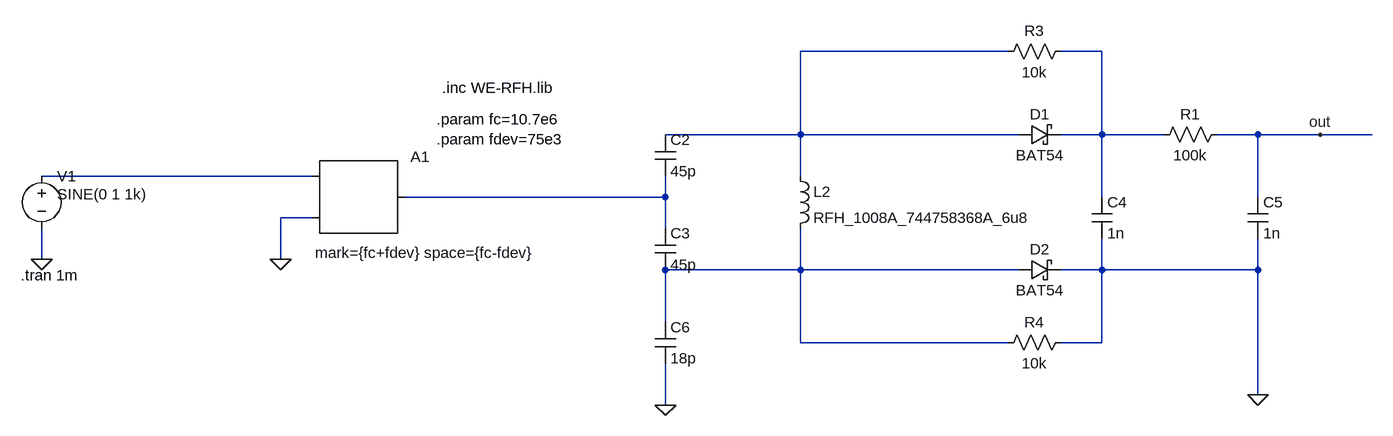
[diagram p0: schematic Weiss_discriminator_actual_values.asc]
Weiss_discriminator_actual_values.asc, the LTspice schematic file:
Version 4
SHEET 1 1816 680
WIRE 1168 -96 848 -96
WIRE 1312 -96 1248 -96
WIRE 848 32 848 -96
WIRE 848 32 640 32
WIRE 1184 32 848 32
WIRE 1312 32 1312 -96
WIRE 1312 32 1248 32
WIRE 1408 32 1312 32
WIRE 1552 32 1488 32
WIRE 1648 32 1552 32
WIRE 1728 32 1648 32
WIRE 96 96 -320 96
WIRE 848 96 848 32
WIRE 640 128 640 96
WIRE 640 128 240 128
WIRE 1312 128 1312 32
WIRE 1552 128 1552 32
WIRE 96 160 48 160
WIRE 640 176 640 128
WIRE -320 224 -320 176
WIRE 48 224 48 160
WIRE 1552 240 1552 192
WIRE 848 240 848 176
WIRE 848 240 640 240
WIRE 1184 240 848 240
WIRE 1312 240 1312 192
WIRE 1312 240 1248 240
WIRE 1552 240 1312 240
WIRE 640 320 640 240
WIRE 848 352 848 240
WIRE 1168 352 848 352
WIRE 1312 352 1312 240
WIRE 1312 352 1248 352
WIRE 1552 432 1552 240
WIRE 640 448 640 384
FLAG 48 224 0
FLAG -320 224 0
FLAG 640 448 0
FLAG 1552 432 0
FLAG 1648 32 out
SYMBOL SpecialFunctions\\modulate 96 96 R0
WINDOW 3 5 118 Left 2
SYMATTR Value mark={fc+fdev} space={fc-fdev}
SYMATTR InstName A1
SYMBOL voltage -320 80 R0
WINDOW 123 0 0 Left 0
WINDOW 39 0 0 Left 0
WINDOW 3 24 44 Left 2
SYMATTR Value SINE(0 1 1k)
SYMATTR InstName V1
SYMBOL cap 624 32 R0
SYMATTR InstName C2
SYMATTR Value 45p
SYMBOL cap 624 176 R0
SYMATTR InstName C3
SYMATTR Value 45p
SYMBOL schottky 1184 48 R270
WINDOW 0 32 32 VTop 2
WINDOW 3 0 32 VBottom 2
SYMATTR InstName D1
SYMATTR Value BAT54
SYMATTR Description Diode
SYMATTR Type diode
SYMBOL schottky 1184 256 R270
WINDOW 0 32 32 VTop 2
WINDOW 3 0 32 VBottom 2
SYMATTR InstName D2
SYMATTR Value BAT54
SYMATTR Description Diode
SYMATTR Type diode
SYMBOL cap 1296 128 R0
SYMATTR InstName C4
SYMATTR Value 1n
SYMBOL res 1504 16 R90
WINDOW 0 0 56 VBottom 2
WINDOW 3 32 56 VTop 2
SYMATTR InstName R1
SYMATTR Value 100k
SYMBOL cap 1536 128 R0
SYMATTR InstName C5
SYMATTR Value 1n
SYMBOL cap 624 320 R0
SYMATTR InstName C6
SYMATTR Value 18p
SYMBOL res 1264 -112 R90
WINDOW 0 0 56 VBottom 2
WINDOW 3 32 56 VTop 2
SYMATTR InstName R3
SYMATTR Value 10k
SYMBOL res 1264 336 R90
WINDOW 0 0 56 VBottom 2
WINDOW 3 32 56 VTop 2
SYMATTR InstName R4
SYMATTR Value 10k
SYMBOL ind 832 80 R0
SYMATTR InstName L2
SYMATTR Value RFH_1008A_744758368A_6u8
SYMATTR Prefix X
TEXT -352 248 Left 2 !.tran 1m
TEXT 288 8 Left 2 !.param fc=10.7e6\n.param fdev=75e3
TEXT 296 -40 Left 2 !.inc WE-RFH.lib

The netlist it stands for:
* Weiss_discriminator_actual_values.asc
A1 N003 0 0 0 0 0 N004 0 MODULATOR mark={fc+fdev} space={fc-fdev}
V1 N003 0 SINE(0 1 1k)
C2 N001 N004 45p
C3 N004 N005 45p
D1 N001 N002 BAT54
D2 N005 0 BAT54
C4 N002 0 1n
R1 out N002 100k
C5 out 0 1n
C6 N005 0 18p
R3 N002 N001 10k
R4 0 N005 10k
XL2 N001 N005 RFH_1008A_744758368A_6u8  ; pins A B
.model D D
.lib standard.dio
.tran 1m
.param fc=10.7e6
.param fdev=75e3
.inc WE-RFH.lib
.backanno
.end